# Altium schematic sheet Sheet1.SchDoc
size A4; SheetNumber: 1; SheetTotal: 1; SPICEModelCacheMFUPUCCV: <root> / <DocumentId>MFUPUCCV</DocumentId> / <CacheFrame Number="0"> / <Model Name="led0" Kind="MDL"> / <Text>*Typ INFRARED GaAs LED: Vf=1.2V Vr=5V If=40mA trr=3uS / *LED Pinout: 1=A, 2=K / .MODEL LED0 D (IS=93.5P RS=84M N=2.63 BV=5 IBV=10U / + CJO=2.97P VJ=.75 M=.333 TT=4.32U)</Text> / </Model> / </CacheFrame> / </root>
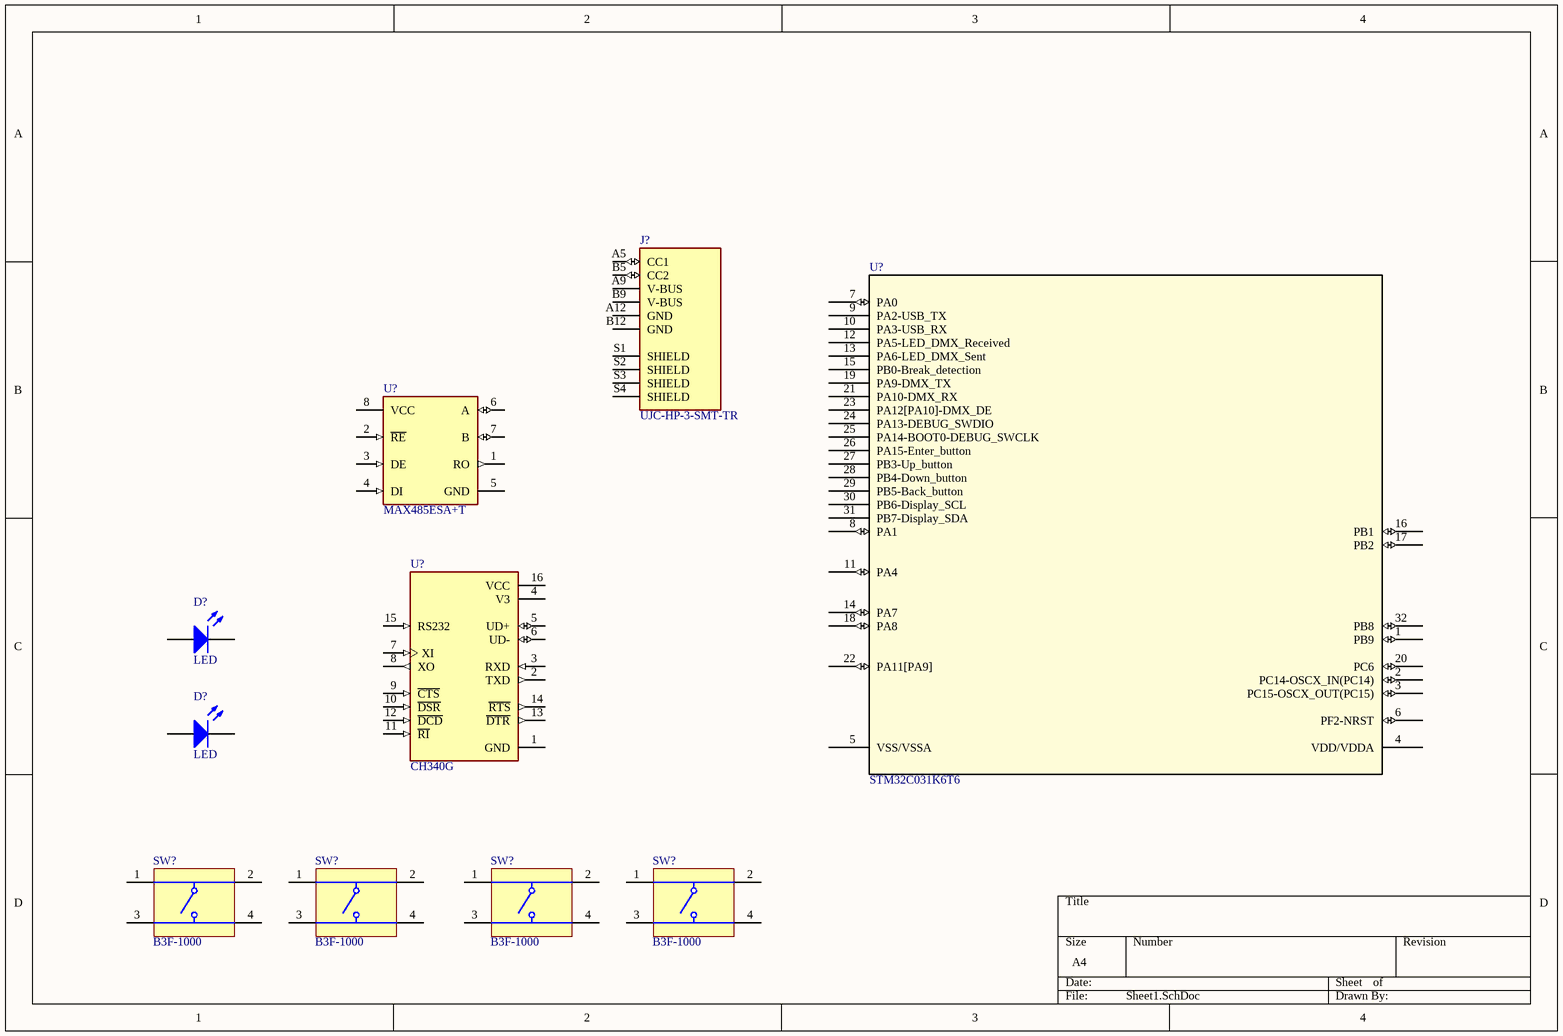
[diagram p0: Sheet1.SchDoc]

## Parts
(Parts that share a designator on the sheet are numbered #1, #2 ... from top to bottom, then left to right.)
D?#1  LED  [LED-0603-R]
D?#2  LED  [LED-0603-G]
J?  UJC-HP-3-SMT-TR  [CUI_UJC-HP-3-SMT-TR]
SW?#1  B3F-1000  [OMRON-B3F-1000-4_V]
SW?#2  B3F-1000  [OMRON-B3F-1000-4_V]
SW?#3  B3F-1000  [OMRON-B3F-1000-4_V]
SW?#4  B3F-1000  [OMRON-B3F-1000-4_V]
U?#1  STM32C031K6T6  [LQFP32_7X7_STM]
U?#2  MAX485ESA+T  [FP-S8-2-MFG]
U?#3  CH340G  [SOIC127P600X180-16N]

## Nets

Not connected (* = marked no-connect by the designer): D?#1 1(A) 2(K); D?#2 1(A) 2(K); J? A5(CC1) A9(V-BUS) A12(GND) B5(CC2) B9(V-BUS) B12(GND) S1(SHIELD) S2(SHIELD) S3(SHIELD) S4(SHIELD); SW?#1 1 2 3 4; SW?#2 1 2 3 4; SW?#3 1 2 3 4; SW?#4 1 2 3 4; U?#1 1(PB9) 2(PC14-OSCX_IN(PC14)) 3(PC15-OSCX_OUT(PC15)) 4(VDD/VDDA) 5(VSS/VSSA) 6(PF2-NRST) 7(PA0) 8(PA1) 9(PA2-USB_TX) 10(PA3-USB_RX) 11(PA4) 12(PA5-LED_DMX_Received) 13(PA6-LED_DMX_Sent) 14(PA7) 15(PB0-Break_detection) 16(PB1) 17(PB2) 18(PA8) 19(PA9-DMX_TX) 20(PC6) 21(PA10-DMX_RX) 22(PA11[PA9]) 23(PA12[PA10]-DMX_DE) 24(PA13-DEBUG_SWDIO) 25(PA14-BOOT0-DEBUG_SWCLK) 26(PA15-Enter_button) 27(PB3-Up_button) 28(PB4-Down_button) 29(PB5-Back_button) 30(PB6-Display_SCL) 31(PB7-Display_SDA) 32(PB8); U?#2 1(RO) 2(~{RE}) 3(DE) 4(DI) 5(GND) 6(A) 7(B) 8(VCC); U?#3 1(GND) 2(TXD) 3(RXD) 4(V3) 5(UD+) 6(UD-) 7(XI) 8(XO) 9(~{CTS}) 10(~{DSR}) 11(~{RI}) 12(~{DCD}) 13(~{DTR}) 14(~{RTS}) 15(RS232) 16(VCC)

## Library data of the parts
J? = UJC-HP-3-SMT-TR: Type C, 3 A, Right Angle, Surface Mount (SMT), Power-Only USB Receptacle; Value: *; Availability: Unavailable; Price: None; Package: None; MP: UJC-HP-3-SMT-TR
SW?#1-SW?#4 = CMP-011-00004-2: Tactile Switch, SPST-NO, 0.05 A, 24 V, -25 to 70 degC, 4-Pin THD, RoHS, Bulk; Manufacturer: Omron Electronic Components; Throw Configuration: SPST; Max Contact Resistance: 100mohm; Resistance: 0.1Ohm; Max Current Rating: 50mA; Voltage Rating: 24V; Operating Force: 100gf; Datasheet Version: Jan-15; Case/Package: B3F-1000; Packaging: Bulk; Package Description: 4-Pin Through Hole Device, Body 6 x 6 mm; Manufacturer URL: http://www.omron.com/; Package Reference: B3F-1000; Contact Plating: Gold; Contact Current Rating: 50mA; RoHS Compliant: True; Contact Material: Gold; Mounting Technology: TH; Max Operating Temperature: 70°C; Min Operating Temperature: -25°C; Package Quantity: 1500; Datasheet URL: http://www.omron.com/ecb/products/pdf/en-b3f.pdf; Voltage Rating (DC): 24V; Pins: 4; Current Rating: 50mA; Max Voltage Rating (DC): 24V
U?#1 = STM32C031K6T6: No Description Available; Mfr_Name: STMicroelectronics; RefDes: RefDes; Type: Type
U?#2 = CMP-015-00008-1: Line Transceiver, 1 Func, 1 Driver, 1 Rcvr, CMOS, PDSO8; Max Supply Voltage: 5.25V; Min Supply Voltage: 4.75V; RoHS Compliant: Yes; Max Operating Temperature: 85°C; Min Operating Temperature: -40°C
U?#3 = CH340G: USB Interface Integrated Circuit; MF: WCH; Value: *; SnapEDA_Link: https://www.snapeda.com/parts/Ch340G/WCH/view-part/?ref=snap; MP: Ch340G; Check_prices: https://www.snapeda.com/parts/Ch340G/WCH/view-part/?ref=eda; Availability: Not in stock; Price: None; Package: None
D?#1 D?#2 = LED: Manufacturer: *; PartNumber: *; Package Type: *